# EAGLE schematic rele (EAGLE 6.1)
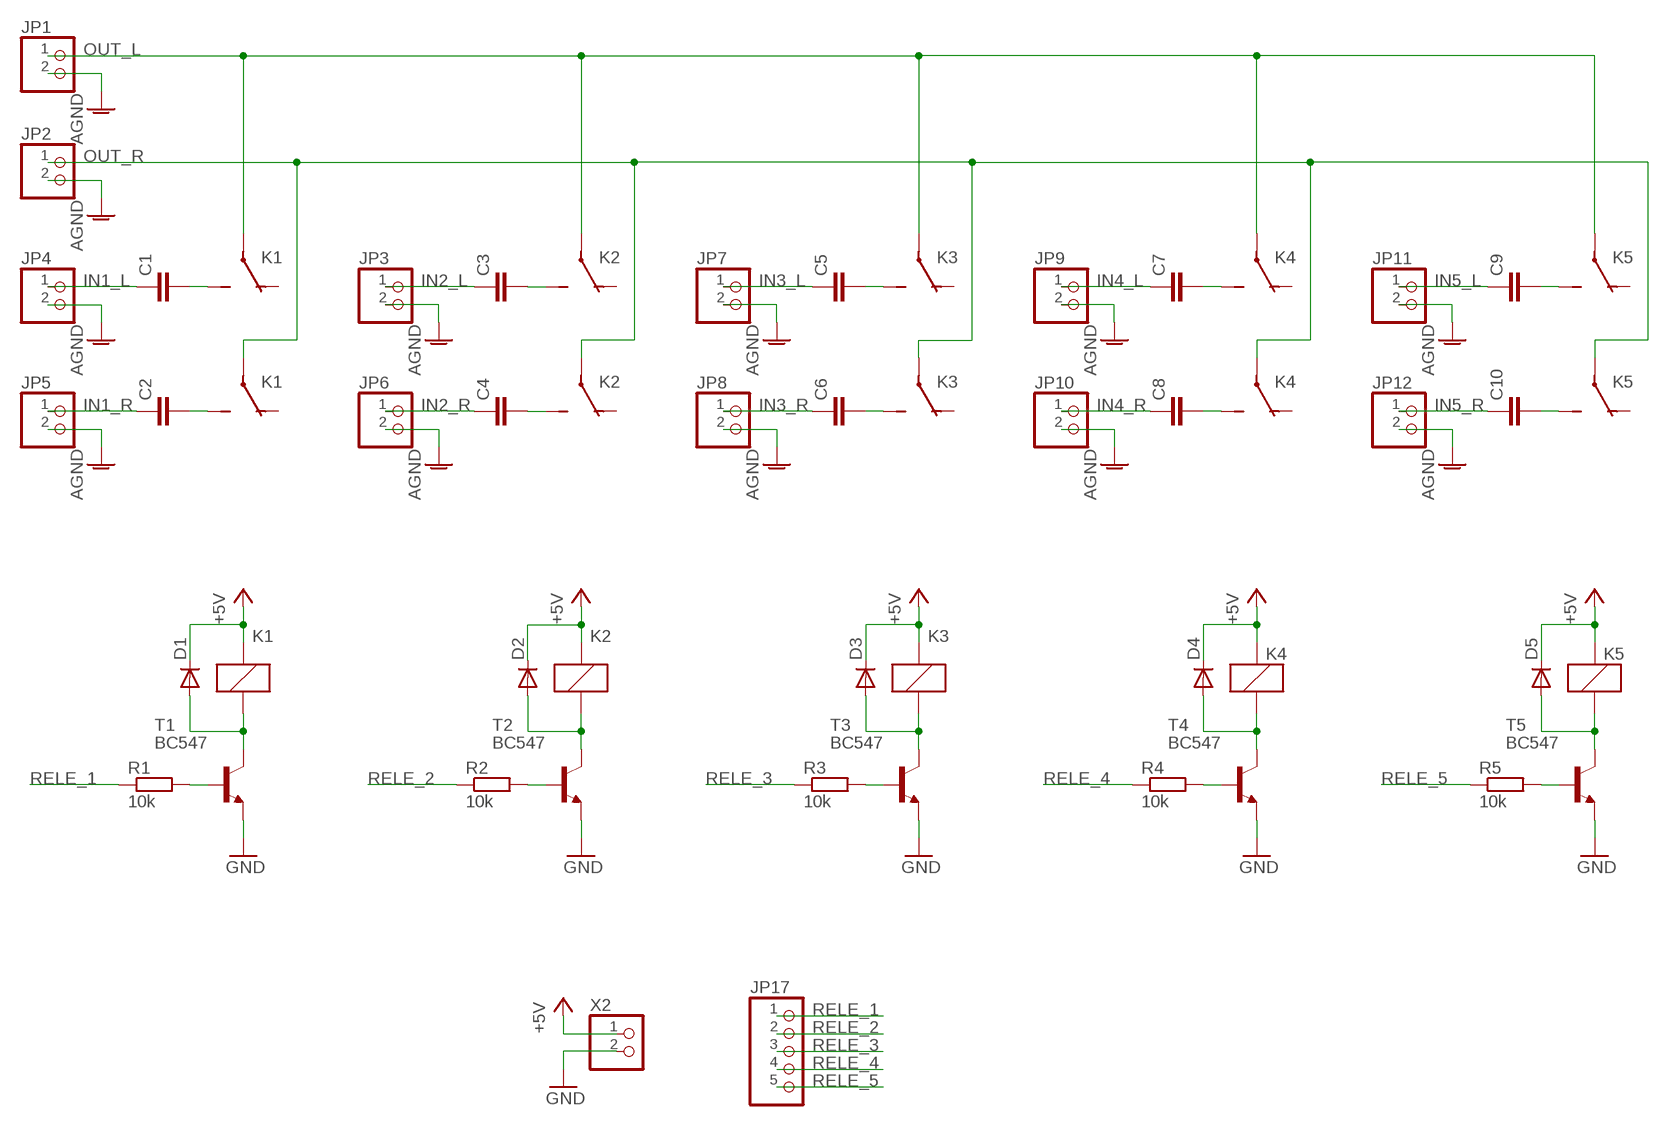
[diagram p0: schematic, sheet 1]

## Parts
C1  C-EU050-025X075  [C050-025X075]
C2  C-EU050-025X075  [C050-025X075]
C3  C-EU050-025X075  [C050-025X075]
C4  C-EU050-025X075  [C050-025X075]
C5  C-EU050-025X075  [C050-025X075]
C6  C-EU050-025X075  [C050-025X075]
C7  C-EU050-025X075  [C050-025X075]
C8  C-EU050-025X075  [C050-025X075]
C9  C-EU050-025X075  [C050-025X075]
C10  C-EU050-025X075  [C050-025X075]
D1  1N4004A  [DO41-5]
D2  1N4004A  [DO41-5]
D3  1N4004A  [DO41-5]
D4  1N4004A  [DO41-5]
D5  1N4004A  [DO41-5]
JP1  PINHD-1X2  [1X02]
JP2  PINHD-1X2  [1X02]
JP3  PINHD-1X2  [1X02]
JP4  PINHD-1X2  [1X02]
JP5  PINHD-1X2  [1X02]
JP6  PINHD-1X2  [1X02]
JP7  PINHD-1X2  [1X02]
JP8  PINHD-1X2  [1X02]
JP9  PINHD-1X2  [1X02]
JP10  PINHD-1X2  [1X02]
JP11  PINHD-1X2  [1X02]
JP12  PINHD-1X2  [1X02]
JP17  PINHD-1X5  [1X05]
K1  MICRO-RELAY  [MICRO-RELAY]
K2  MICRO-RELAY  [MICRO-RELAY]
K3  MICRO-RELAY  [MICRO-RELAY]
K4  MICRO-RELAY  [MICRO-RELAY]
K5  MICRO-RELAY  [MICRO-RELAY]
R1  10k  R-EU_0207/7  [0207/7]
R2  10k  R-EU_0207/7  [0207/7]
R3  10k  R-EU_0207/7  [0207/7]
R4  10k  R-EU_0207/7  [0207/7]
R5  10k  R-EU_0207/7  [0207/7]
T1  BC547  BC547-  [TO92-]
T2  BC547  BC547-  [TO92-]
T3  BC547  BC547-  [TO92-]
T4  BC547  BC547-  [TO92-]
T5  BC547  BC547-  [TO92-]
X2  22-23-2021  [22-23-2021]

## Nets
+5V: D1.C D2.C D3.C D4.C D5.C K1.A1 K2.A1 K3.A1 K4.A1 K5.A1 X2.1
AGND: JP1.2 JP2.2 JP3.2 JP4.2 JP5.2 JP6.2 JP7.2 JP8.2 JP9.2 JP10.2 JP11.2 JP12.2
GND: T1.1(E) T2.1(E) T3.1(E) T4.1(E) T5.1(E) X2.2
IN1_L: C1.1 JP4.1
IN1_R: C2.1 JP5.1
IN2_L: C3.1 JP3.1
IN2_R: C4.1 JP6.1
IN3_L: C5.1 JP7.1
IN3_R: C6.1 JP8.1
IN4_L: C7.1 JP9.1
IN4_R: C8.1 JP10.1
IN5_L: C9.1 JP11.1
IN5_R: C10.1 JP12.1
N$1: C2.2 K1.24(-2:S)
N$2: C1.2 K1.14(-1:S)
N$3: D1.A K1.A2 T1.2(C)
N$4: R1.2 T1.3(B)
N$5: C3.2 K2.14(-1:S)
N$6: C4.2 K2.24(-2:S)
N$7: C6.2 K3.24(-2:S)
N$8: C5.2 K3.14(-1:S)
N$9: C8.2 K4.24(-2:S)
N$10: C7.2 K4.14(-1:S)
N$11: D2.A K2.A2 T2.2(C)
N$12: D3.A K3.A2 T3.2(C)
N$13: D4.A K4.A2 T4.2(C)
N$14: R2.2 T2.3(B)
N$15: R3.2 T3.3(B)
N$16: R4.2 T4.3(B)
N$17: C10.2 K5.24(-2:S)
N$18: C9.2 K5.14(-1:S)
N$19: D5.A K5.A2 T5.2(C)
N$20: R5.2 T5.3(B)
OUT_L: JP1.1 K1.11(-1:P) K2.11(-1:P) K3.11(-1:P) K4.11(-1:P) K5.11(-1:P)
OUT_R: JP2.1 K1.21(-2:P) K2.21(-2:P) K3.21(-2:P) K4.21(-2:P) K5.21(-2:P)
RELE_1: JP17.1 R1.1
RELE_2: JP17.2 R2.1
RELE_3: JP17.3 R3.1
RELE_4: JP17.4 R4.1
RELE_5: JP17.5 R5.1
Unconnected: K1.12(-1:O) K1.22(-2:O) K2.12(-1:O) K2.22(-2:O) K3.12(-1:O) K3.22(-2:O) K4.12(-1:O) K4.22(-2:O) K5.12(-1:O) K5.22(-2:O)

## Library data of the parts
C1-C10 = amp:C-EU: CAPACITOR, European symbol
D1-D5 = amp:1N4004: DIODE general purpose rectifier, 1 A
JP1-JP12 = amp:PINHD-1X2: PIN HEADER
JP17 = amp:PINHD-1X5: PIN HEADER
K1-K5 = amp:MICRO-RELAY
R1-R5 = amp:R-EU_: RESISTOR, European symbol
T1-T5 = amp:BC547: NPN TRANSISTOR
X2 = amp:22-23-2021: .100" (2.54mm) Center Header - 2 Pin